# EAGLE design nrf52840-contact-v03 (EAGLE 7.7.0)
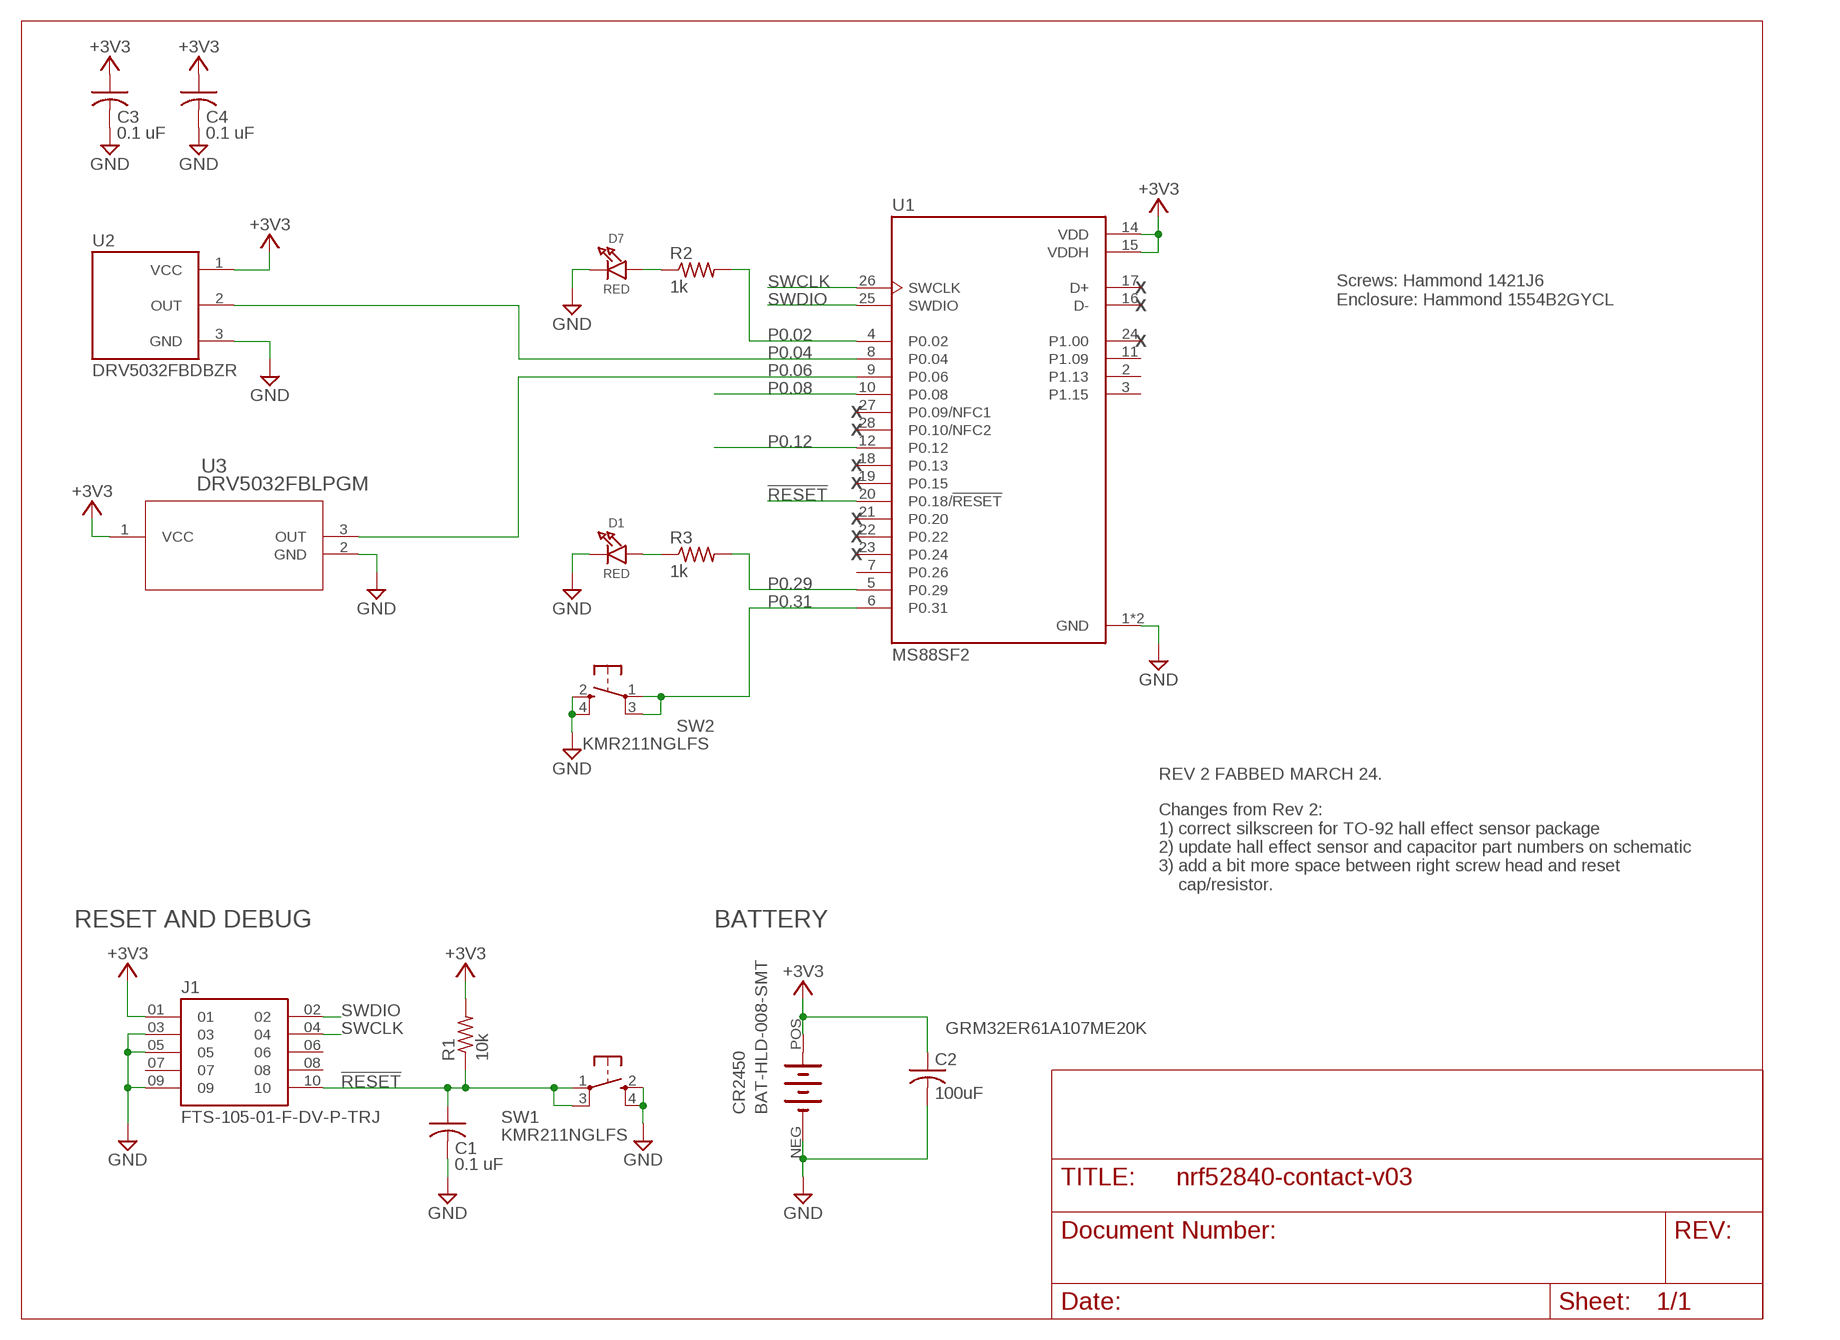
[diagram p0: schematic, sheet 1]

## Parts
C1  0.1 uF  C-USC0603K  [C0603K]
C2  100uF  C-USC1210K  [C1210K]
C3  0.1 uF  C-USC0603K  [C0603K]
C4  0.1 uF  C-USC0603K  [C0603K]
CR2450  BAT-HLD-008-SMT  [BAT-HLD-008-SMT]
D1  RED  LED0805_NOOUTLINE  [CHIPLED_0805_NOOUTLINE]
D7  RED  LED0805_NOOUTLINE  [CHIPLED_0805_NOOUTLINE]
J1  FTS-105-01-F-DV-P-TRJ  [SAMTEC_FTS-105-01-F-DV-P-TR]
R1  10k  R-US_R0603  [R0603]
R2  1k  R-US_R0603  [R0603]
R3  1k  R-US_R0603  [R0603]
SW1  KMR211NGLFS  SPST_TACT-KMR2  [KMR2]
SW2  KMR211NGLFS  SPST_TACT-KMR2  [KMR2]
U1  MS88SF2  [XCVR_MS88SF2]
U2  DRV5032FBDBZR  [SOT95P237X112-3N]
U3  DRV5032FBLPGM  DRV5032AJLPG  [TO-92-3_DRV5032A_4X3P15_TEX]

## Nets
!RESET: C1.1 J1.10 R1.1 SW1.1(P) SW1.3(P1) U1.20(P0.18/!RESET)
+3V3: C2.1 C3.1 C4.1 CR2450.POS(+) J1.01 R1.2 U1.14(VDD) U1.15(VDDH) U2.1(VCC) U3.1(VCC)
GND: C1.2 C2.2 C3.2 C4.2 CR2450.NEG(-) D1.C D7.C J1.03 J1.05 J1.09 SW1.2(S) SW1.4(S1) SW2.2(S) SW2.4(S1) U1.1(GND) U1.13(GND) U2.3(GND) U3.2(GND)
N$2: D7.A R2.1
N$4: D1.A R3.1
P0.02: R2.2 U1.4(P0.02)
P0.04: U1.8(P0.04) U2.2(OUT)
P0.06: U1.9(P0.06) U3.3(OUT)
P0.08: U1.10(P0.08)
P0.12: U1.12(P0.12)
P0.29: R3.2 U1.5(P0.29)
P0.31: SW2.1(P) SW2.3(P1) U1.6(P0.31)
SWCLK: J1.04 U1.26(SWCLK)
SWDIO: J1.02 U1.25(SWDIO)
Unconnected: J1.06 J1.07 J1.08 U1.2(P1.13) U1.3(P1.15) U1.7(P0.26) U1.11(P1.09) U1.16(D-) U1.17(D+) U1.18(P0.13) U1.19(P0.15) U1.21(P0.20) U1.22(P0.22) U1.23(P0.24) U1.24(P1.00) U1.27(P0.09/NFC1) U1.28(P0.10/NFC2)

## Notes on the sheet
- X
- X
- Screws: Hammond 1421J6
  Enclosure: Hammond 1554B2GYCL
- X
- X
- X
- X
- X
- X
- X
- X
- REV 2 FABBED MARCH 24.
- Changes from Rev 2:
  1) correct silkscreen for TO-92 hall effect sensor package
  2) update hall effect sensor and capacitor part numbers on schematic
  3) add a bit more space between right screw head and reset 
      cap/resistor.
- RESET AND DEBUG | BATTERY
- GRM32ER61A107ME20K

## Library data of the parts
C1-C4 = rcl:C-US: CAPACITOR, American symbol
CR2450 = BAT-HLD-008-SMT:BAT-HLD-008-SMT
D1 D7 = microbuilder:LED: LED 0603 - 0603 Surface Mount Package 2mA: Green LED - Low Power (3.9mcd, 2ma, 1.7Vf) - Digikey: 475-2709-2-ND Orange LED - Low Power (9.8mcd, 2ma, 1.8Vf) - Digikey: 475-1194-2-ND Red LED - Low Power (5mcd, 2ma, 1.8Vf) - Digikey: 475-1195-2-ND Yellow LED - Low Power (7mcd, 2ma, 1.8Vf) - Digikey: 475-1196-2-ND 5mA: Blue LED - Low Power (17mcd, 5ma, 2.9Vf) - Digikey: LNJ937W8CRACT-ND 0805 - 0805 Surface Mount Package 2mA: Red LED (8.8mcd, 2mA, 1.8Vf, Clear) - Low Power [Digikey: 475-2510-1-ND] Green LED (5mcd, 2mA, 1.8Vf, Clear) - Low Power [Digikey: 475-2730-1-ND] Yellow LED (11.3mcd, 2mA, 1.8Vf, Clear) - Low Power [Digikey: 475-2555-1-ND] 20mA: Red LED (104mcd, 20mA, Diffused) - LS R976 [Digikey: 475-1278-6-ND] Red LED (12mcd, 20mA, 2.0Vf, Clear) - APT2012EC [Digikey: 754-1128-1-ND] Green LED (15mcd, 20mA, 2.2Vf, Clear) - APT2012GC [Digikey: 754-1131-1-ND] Orange LED (160mcd, 20mA, 2.1Vf, Clear) - APT2012SECK [Digikey: 754-1130-1-ND] 1206 - 1206 Surface Mount Package Green LED (26mcd, 20mA, Diffused) - LG N971 [Digikey: 475-1407-6-ND] Red LED (15mcd, 20mA, Diffused) - LH N974 [Digikey: 475-1416-6-ND] Cree - Cree High-Power Surface Mount LEDs XPEBWT-L1-0000-00D50 - White 111lm 350mA 2.9Vf 6200K 110° XTEAWT-00-0000-00000LEE3 - White 114lm 350mA 2.85Vf 5000K 115° Everlight - Everlight 45-21 Series Surface Mount LEDs 45-21/QK2C-B2832AC2CB2/2T - Warm White 2000mcd 20mA 3.25Vf 3050K 120° 45-21/LK2C-B38452C4CB2/2T - Nuetral White 2000mcd 20mA 3.25Vf 4150K 120° 45-21/LK2C-B50634C6CB2/2T - Cold White 2200mcd 20mA 3.25Vf 5650K 120° PLCC2 Reverse Mount LS T77K-J1L2-1-0-2-R18-Z - Red 11.25mcd 2mA 1.8Vf 630nm 120° LO T77K-L1M2-24-Z - Orange 19.6mcd 2mA 1.8Vf 606nm 120° LY T77K-K2M1-26-Z - Yellow 15.7mcd 2mA 1.8Vf 587nm 120°
J1 = FTS-105-01-F-DV-P-TR:FTS-105-01-F-DV-P-TR: Check availability <https://pricing.snapeda.com/parts/FTS-105-01-F-DV-P-TR/Samtec/view-part?ref=eda>; AVAILABILITY: In Stock; DESCRIPTION: FTS - Samtec 1.27mm Micro Header 0.86mm Profile 3.05mm Post; MF: Samtec; MP: FTS-105-01-F-DV-P-TR; PACKAGE: None; PRICE: None; PURCHASE-URL: https://pricing.snapeda.com/search/part/FTS-105-01-F-DV-P-TR/?ref=eda
R1-R3 = rcl:R-US_: RESISTOR, American symbol
SW1 SW2 = adafruit:SPST_TACT: SMT 6mm switch, EVQQ2 series http://www.ladyada.net/library/eagle
U1 = MS88SF2:MS88SF2: MS88SF2 is based on Nordic nRF52840 and it is a compact and very small size Bluetooth 5.0 module with the metal cover shield and compliance with IEEE 802.14.4 standard. Check availability <https://pricing.snapeda.com/parts/MS88SF2/Minew/view-part?ref=eda>; AVAILABILITY: Not in stock; CHECK_PRICES: https://www.snapeda.com/parts/MS88SF2/Minew/view-part/?ref=eda; DESCRIPTION: MS88SF2 is based on Nordic nRF52840 and it is a compact and very small size Bluetooth 5.0 module with the metal cover shield and compliance with IEEE 802.14.4 standard.; MF: Minew; MP: MS88SF2; PACKAGE: Package; PRICE: None; SNAPEDA_LINK: https://www.snapeda.com/parts/MS88SF2/Minew/view-part/?ref=snap
U2 = DRV5032FBDBZR:DRV5032FBDBZR; MANUFACTURER: Texas Instruments; MAXIMUM_PACKAGE_HEIGHT: 1.12mm; PARTREV: F; STANDARD: IPC 7351B
U3 = DRV5032AJLPG:DRV5032AJLPG; COPYRIGHT: Copyright (C) 2024 Ultra Librarian. All rights reserved.; MANUFACTURER_PART_NUMBER: DRV5032AJLPG; MFR_NAME: Texas Instruments

## Board
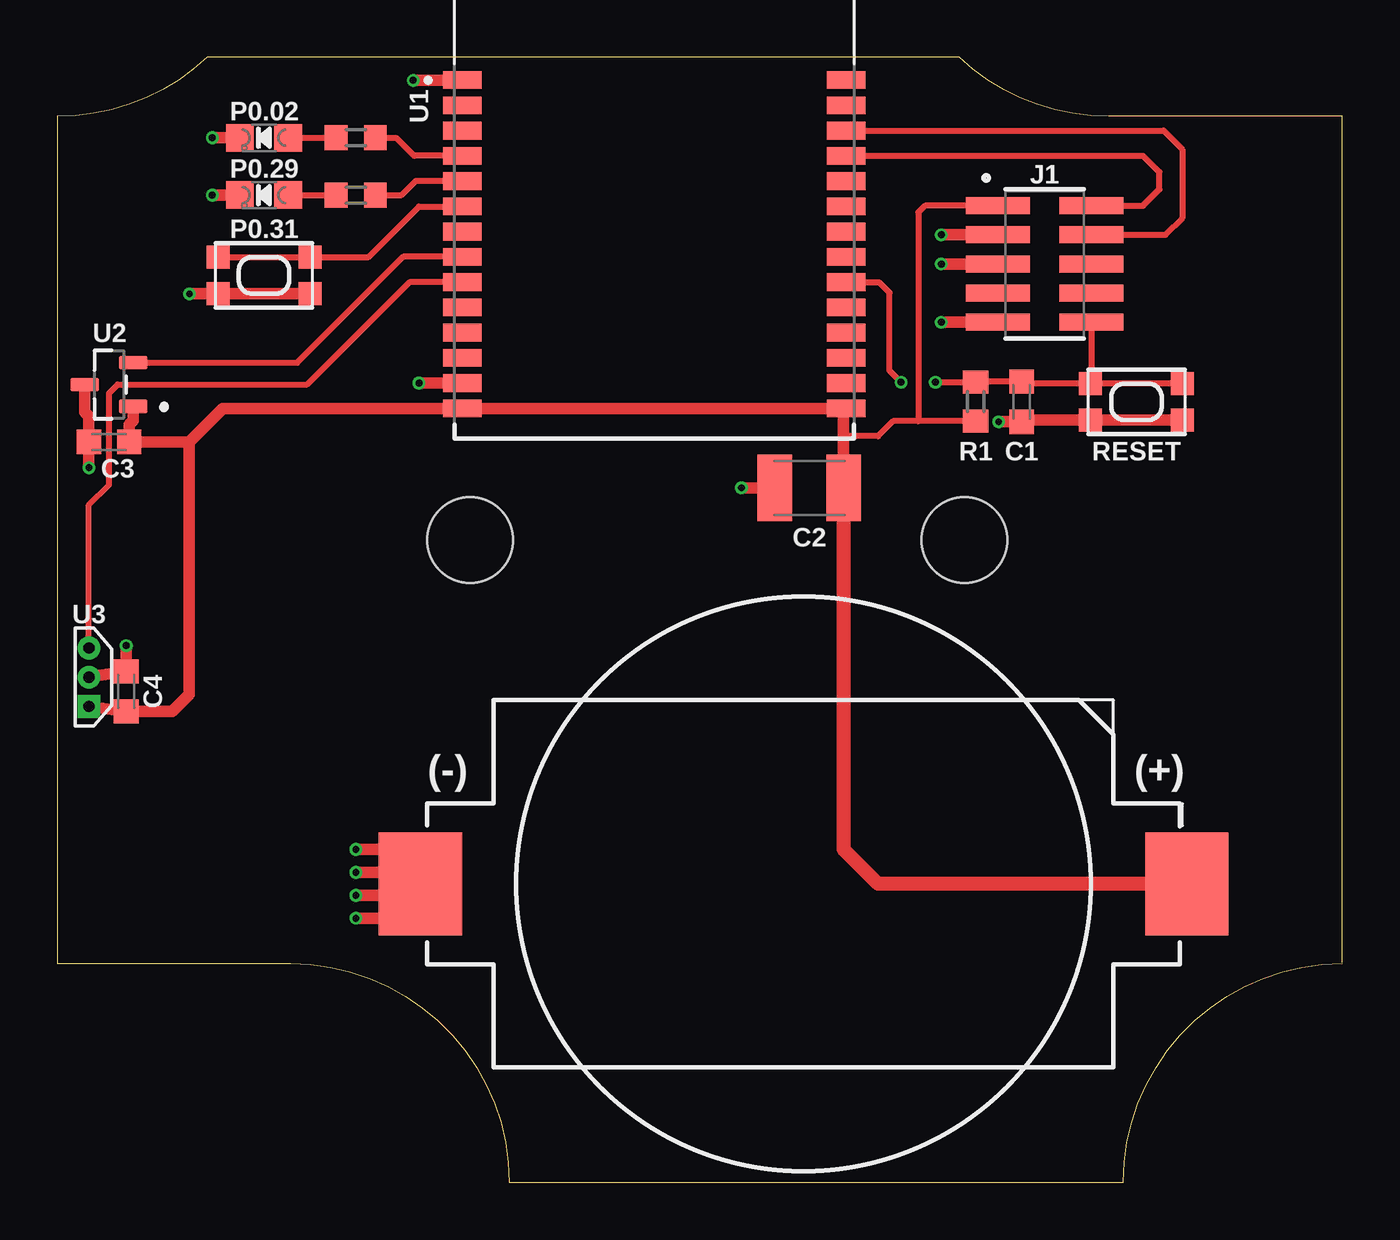
[diagram p1: board, top side]
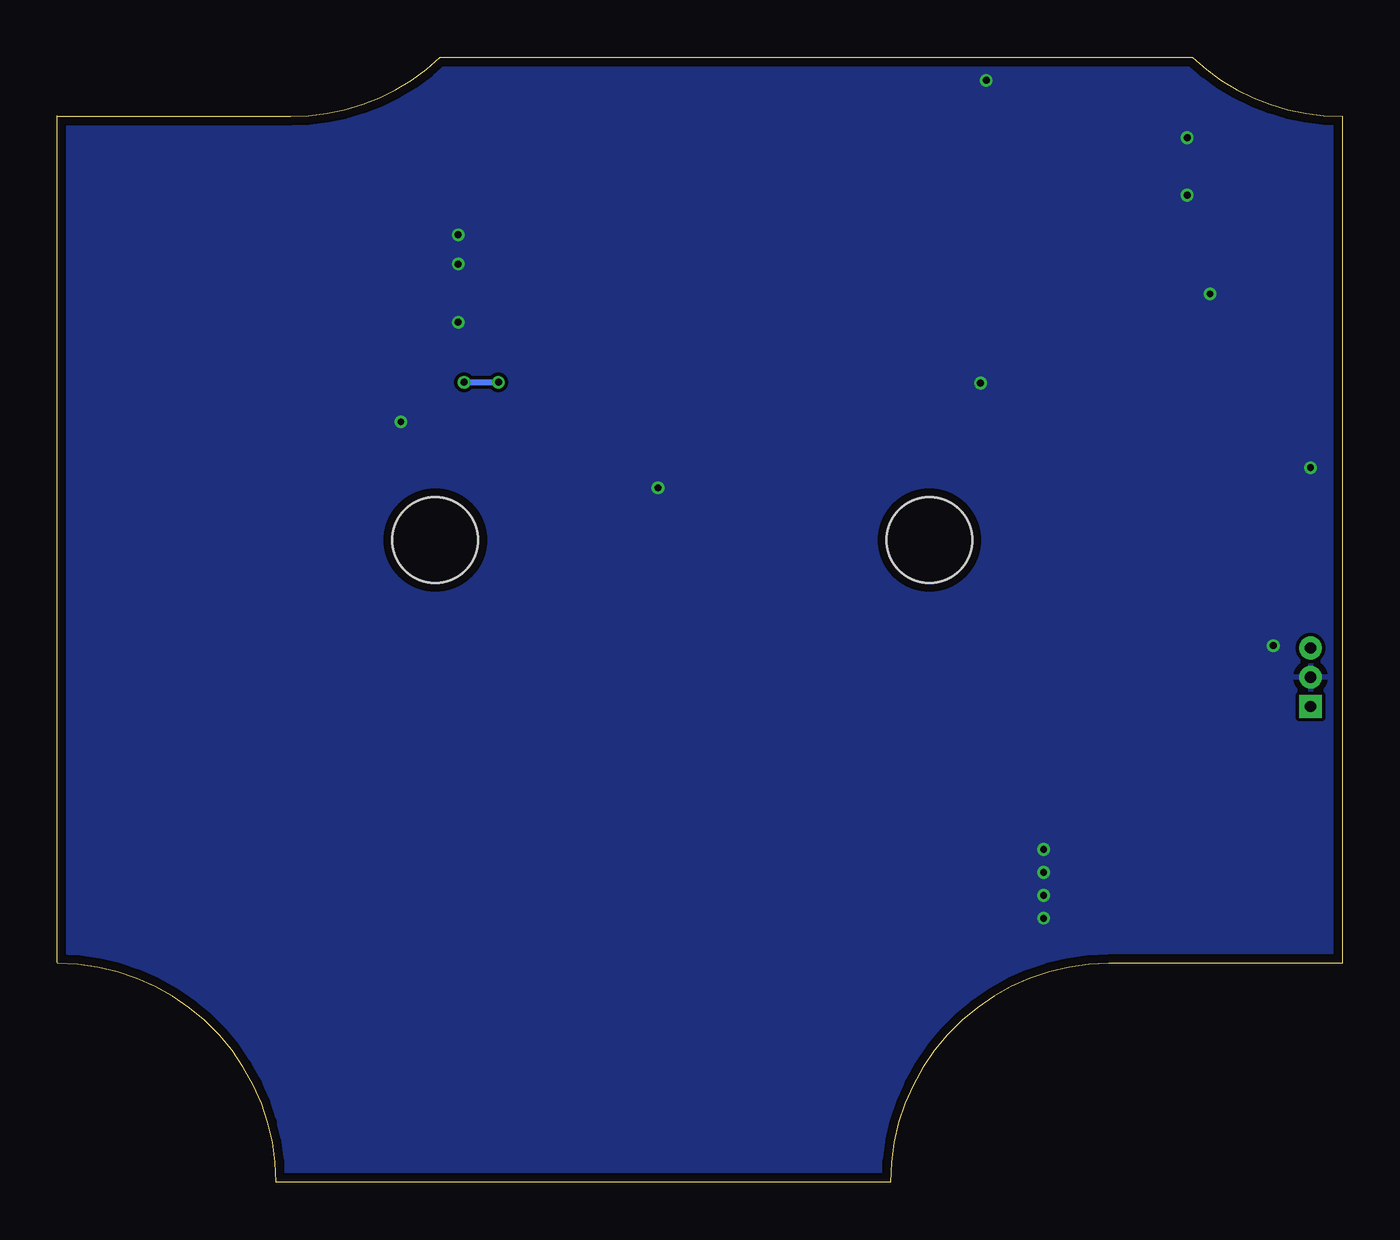
[diagram p2: board, bottom side, seen from below]

Size 55.96 x 49 mm. Coordinates in mm from the lower left corner, seen from the top.
Outline: 55.96,9.53 arc90 46.43,0 19.68,0 arc90 10.15,9.53 0,9.53 0,46.43 arc43 6.53,49 39.28,49 arc43 45.81,46.43 55.96,46.43
Outline: 55.96,9.57 55.96,46.47
Copper layers (1*16): Top 0.035559375mm / dielectric 1.6mm / Bottom 0.035559375mm
Design rules "oshpark-2layer-2018": minimum track width 6mil, minimum drill 10mil, track to track 6mil, track to pad 6mil, pad to pad 6mil, via to via 6mil, smd to smd 6mil, copper to edge 15mil, drill to drill 6mil, minimum pad ring 5mil, minimum via ring 5mil, stop-mask expansion 2.5mil, vias tented up to drill 0mil, thermal gap 10mil
Holes 3.73 mm at 17.97,27.98 39.5,27.98
tRestrict: area 14.5,24.6 to 21.4,31.4; area 36.1,24.6 to 42.9,31.4

### Footprints (pad centres in the part's own frame; a part is rotated, then mirrored left to right if it is on the bottom)
C0603K = smd 1.05 x 1.08: 1 -0.875,0; 2 0.875,0
C1210K = smd 1.5 x 2.9: 1 -1.5,0; 2 1.5,0
BAT-HLD-008-SMT = smd 3.62 x 4.5: NEG 16.69,0; POS -16.69,0
CHIPLED_0805_NOOUTLINE = smd 1.2 x 1.2: A 0,-1.05; C 0,1.05
SAMTEC_FTS-105-01-F-DV-P-TR = smd 0.74 x 2.79: 01 -2.54,-2.035; 02 -2.54,2.035; 03 -1.27,-2.035; 04 -1.27,2.035; 05 0,-2.035; 06 0,2.035; 07 1.27,-2.035; 08 1.27,2.035; 09 2.54,-2.035; 10 2.54,2.035
R0603 = smd 1 x 1.1: 1 -0.85,0; 2 0.85,0
KMR2 = smd 1 x 1: 1 2,0.8; 2 2,-0.8; 3 -2,0.8; 4 -2,-0.8
XCVR_MS88SF2 = smd 1.69 x 0.77: 1 -8.36,4.01; 2 -8.36,2.91; 3 -8.36,1.81; 4 -8.36,0.71; 5 -8.36,-0.39; 6 -8.36,-1.49; 7 -8.36,-2.59; 8 -8.36,-3.69; 9 -8.36,-4.79; 10 -8.36,-5.89; 11 -8.36,-6.99; 12 -8.36,-8.09; 13 -8.36,-9.19; 14 -8.36,-10.29; 15 8.36,-10.29; 16 8.36,-9.19; 17 8.36,-8.09; 18 8.36,-6.99; 19 8.36,-5.89; 20 8.36,-4.79; 21 8.36,-3.69; 22 8.36,-2.59; 23 8.36,-1.49; 24 8.36,-0.39; 25 8.36,0.71; 26 8.36,1.81; 27 8.36,2.91; 28 8.36,4.01
SOT95P237X112-3N = smd 1.24 x 0.59: 1 -1.055,0.95; 2 -1.055,-0.95; 3 1.055,0
TO-92-3_DRV5032A_4X3P15_TEX = drill 0.483 pad 0.991 square: 1 -1.27,0 | drill 0.483 pad 0.991: 2 0,0; 3 1.27,0

### Placement (x,y rotation side)
C1  42,34 270 top
C2  32.75,30.25 180 top
C3  2.25,32.25 180 top
C4  3,21.38 90 top
CR2450  32.5,13 180 top
D1  9,43 90 top
D7  9,45.5 90 top
J1  43,40 270 top
R1  40,34 270 top
R2  13,45.5 0 top
R3  13,43 0 top
SW1  47,34 0 top
SW2  9,39.5 0 top
U1  26,44 0 top
U2  2.25,34.75 180 top
U3  1.38,22 90 top

### Tracks (layer width: path | path; a pad name or v marks a point on that pad's centre or on a via)
!RESET  (via drill 0.3)
  Top 0.152: 45.03,34.84 SW1.3
  Top 0.254: SW1.1 SW1.3 42.08,34.8 C1.1 40.02,34.88 R1.1 v38.25,34.85 | U1.20 35.79,39.21 36.25,38.75 36.25,35.35 v36.75,34.85 | J1.10 45.03,34.84
  Bottom 0.254: v38.25,34.85 v36.75,34.85
+3V3
  Top 0.254: R1.2 37.5,33.15 | 34.25,32.5 35.75,32.5 36.4,33.15 37.5,33.15 | J1.01 37.79,42.54 37.5,42.25 37.5,33.15
  Top 0.508: C2.1 34.25,32.5 34.25,33.71 U1.15 U1.14 7.21,33.71 5.75,32.25 | U2.1 3.31,33.18 3.12,33 C3.1 5.75,32.25 | U3.1 C4.1 5,20.5 5.75,21.25 5.75,32.25
  Top 0.61: CR2450.POS 35.75,13 34.25,14.5 C2.1
GND  (via drill 0.3)
  Top 0.508: C2.2 v29.8,30.25 | D7.C v6.75,45.5 | D1.C v6.75,43 | SW2.2 SW2.4 v5.75,38.7 | U1.13 v15.75,34.81 | U1.1 v15.51,48.01 v15.5,48 | v41,33.12 C1.2 42.08,33.2 SW1.4 SW1.2 | J1.03 v38.5,41.27 | J1.05 v38.5,40 | J1.09 v38.5,37.46 | v13,14.5 14.5,14.5 | v13,13.5 14.5,13.5 | v13,12.5 15.31,12.5 CR2450.NEG | v13,11.5 14.5,11.5 | U2.3 1.2,33.55 1.38,33.38 C3.2 v1.38,31.12 | U3.2 C4.2 v3,23.38
  pour Bottom (isolate 0.152): 0,9.53 10.15,9.53 arc-90 19.68,0 46.43,0 arc-90 55.96,9.53 55.96,46.43 45.81,46.43 arc-43 39.28,49 6.53,49 arc-43 0,46.43
N$2
  Top 0.254: D7.A R2.1
N$4
  Top 0.254: D1.A R3.1
P0.02
  Top 0.254: R2.2 14.75,45.5 15.54,44.71 U1.4
P0.04
  Top 0.254: U2.2 10.45,35.7 15.06,40.31 U1.8
P0.06
  Top 0.254: U3.3 1.38,29.5 2.25,30.38 2.25,34.38 2.62,34.75 10.88,34.75 15.34,39.21 U1.9
P0.29
  Top 0.254: R3.2 15,43 15.61,43.61 U1.5
P0.31
  Top 0.254: SW2.3 SW2.1 13.55,40.3 15.75,42.5 U1.6
SWCLK
  Top 0.254: U1.26 48.19,45.81 49,45 49,42 48.27,41.27 J1.04
SWDIO
  Top 0.254: U1.25 47.29,44.71 48,44 48,43.25 47.29,42.54 J1.02

### Text on the board
_tsilk: P0.02 | U1 | P0.29 | J1 | P0.31 | U2 | C3 | R1 | C1 | RESET | C2 | U3 | C4 | (-) | (+)